# Altium schematic sheet H桥(1).SchDoc
size A4
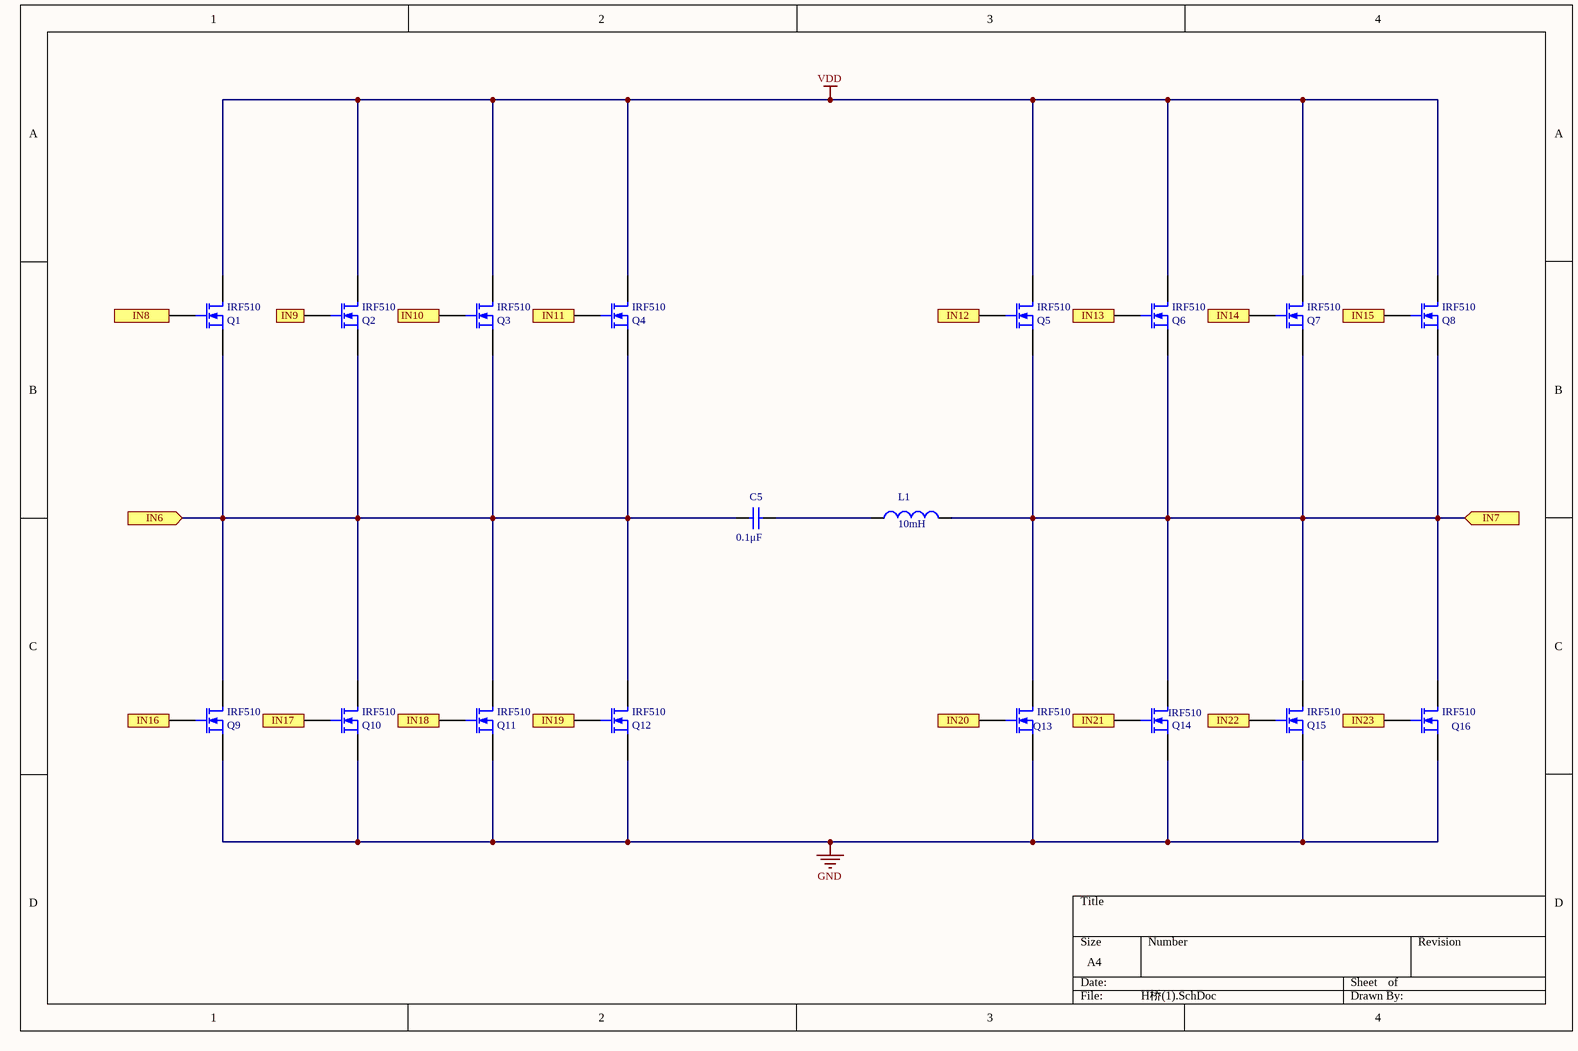
[diagram p0: H桥(1).SchDoc]

## Parts
(Parts that share a designator on the sheet are numbered #1, #2 ... from top to bottom, then left to right.)
C5  value 0.1μF  [RAD-0.3]
IRF510#1  Q1  [E3]
IRF510#2  Q2  [E3]
IRF510#3  Q3  [E3]
IRF510#4  Q4  [E3]
IRF510#5  Q5  [E3]
IRF510#6  Q6  [E3]
IRF510#7  Q7  [E3]
IRF510#8  Q8  [E3]
IRF510#9  Q9  [E3]
IRF510#10  Q10  [E3]
IRF510#11  Q11  [E3]
IRF510#12  Q12  [E3]
IRF510#13  Q13  [E3]
IRF510#14  Q14  [E3]
IRF510#15  Q15  [E3]
IRF510#16  (no value)  [E3]
L1  value 10mH  [0402-A]

## Ports
IN6 (in), IN7 (in), IN8 (in), IN9 (in), IN10 (in), IN11 (in), IN12 (in), IN13 (in), IN14 (in), IN15 (in), IN16 (in), IN17 (in), IN18 (in), IN19 (in), IN20 (in), IN21 (in), IN22 (in), IN23 (in)

## Nets
GND: IRF510#9.3(S) IRF510#10.3(S) IRF510#11.3(S) IRF510#12.3(S) IRF510#13.3(S) IRF510#14.3(S) IRF510#15.3(S) IRF510#16.3(S)
VDD: IRF510#1.1(D) IRF510#2.1(D) IRF510#3.1(D) IRF510#4.1(D) IRF510#5.1(D) IRF510#6.1(D) IRF510#7.1(D) IRF510#8.1(D)
IN6: C5.1 IRF510#1.3(S) IRF510#2.3(S) IRF510#3.3(S) IRF510#4.3(S) IRF510#9.1(D) IRF510#10.1(D) IRF510#11.1(D) IRF510#12.1(D) ; port IN6
IN7: IRF510#5.3(S) IRF510#6.3(S) IRF510#7.3(S) IRF510#8.3(S) IRF510#13.1(D) IRF510#14.1(D) IRF510#15.1(D) IRF510#16.1(D) L1.2 ; port IN7
IN8: IRF510#1.2(G) ; port IN8
IN9: IRF510#2.2(G) ; port IN9
IN10: IRF510#3.2(G) ; port IN10
IN11: IRF510#4.2(G) ; port IN11
IN12: IRF510#5.2(G) ; port IN12
IN13: IRF510#6.2(G) ; port IN13
IN14: IRF510#7.2(G) ; port IN14
IN15: IRF510#8.2(G) ; port IN15
IN16: IRF510#9.2(G) ; port IN16
IN17: IRF510#10.2(G) ; port IN17
IN18: IRF510#11.2(G) ; port IN18
IN19: IRF510#12.2(G) ; port IN19
IN20: IRF510#13.2(G) ; port IN20
IN21: IRF510#14.2(G) ; port IN21
IN22: IRF510#15.2(G) ; port IN22
IN23: IRF510#16.2(G) ; port IN23
NetC5_2: C5.2 L1.1

## Notes on the sheet
- (near IRF510#16) Q16

## Library data of the parts
C5 = Cap: Capacitor; Published: 8-Jun-2000; LatestRevisionDate: 17-Jul-2002; LatestRevisionNote: Re-released for DXP Platform.; PackageReference: RAD-0.3; Publisher: Altium Limited; PackageDescription: Radial Cap, Thru-Hole; 2 Leads; 0.3 in Pin Spacing
IRF510#1-IRF510#16 = MOSFET-N: N-Channel MOSFET; Published: 8-Jun-2000; LatestRevisionDate: 17-Jul-2002; LatestRevisionNote: Re-released for DXP Platform.; PackageVersion: 1995/1996; PackageReference: E3; Publisher: Altium Limited; PackageDescription: TO, Flat Index; 3 In-Line, Axial Leads; Body Dia. 4.6mm; Lead Dia. 0.5 mm (max)
L1 = Inductor: Code_IEC: 1005; Published: 8-Jun-2000; LatestRevisionDate: 29-May-2009; LatestRevisionNote: IPC-7351 Footprint Added.; PackageReference: 0402-A; Publisher: Altium Limited; PackageDescription: Chip Inductor; Code_JEITA: 0402